# Altium schematic sheet 5-ThermoHygroSensor.SchDoc
size A4; Author: Fabian Castaño; CompanyName: UdeA; Engineer: Fabian Castaño; Organization: Universidad de Antioquia; Address1: UdeA; Address2: Medellín; Address3: Antioquia; Address4: Colombia 050010; DocumentNumber: 6; Revision: Jaime Osorio; SheetNumber: 6; SheetTotal: 12
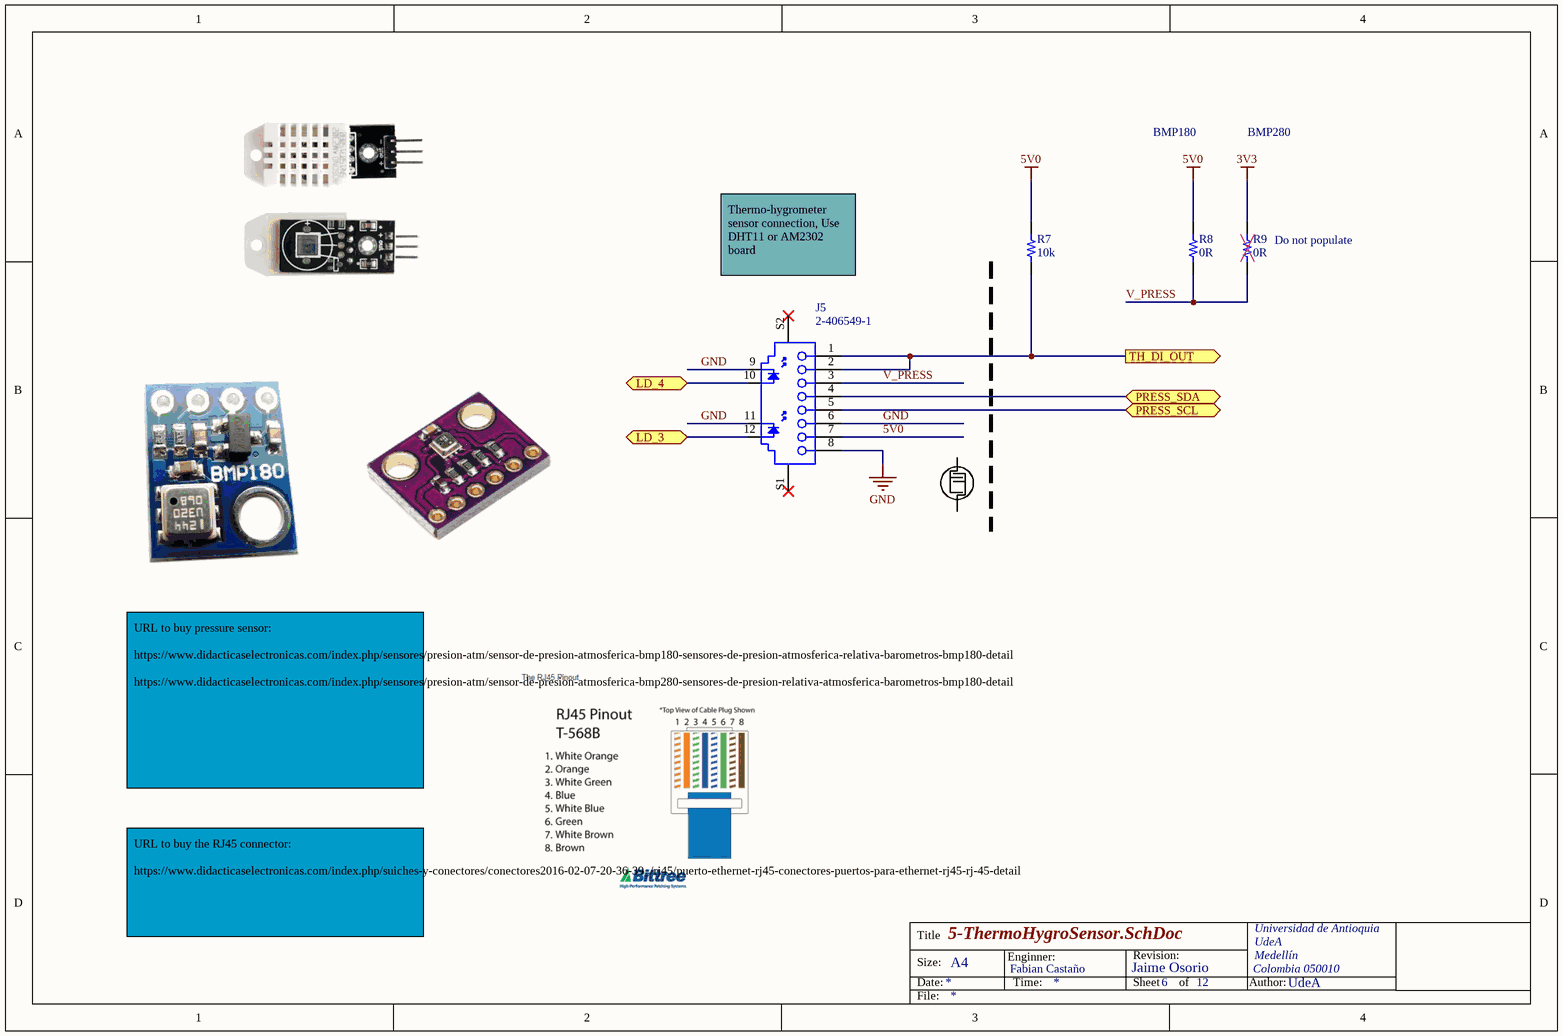
[diagram p0: 5-ThermoHygroSensor.SchDoc]

## Parts
J5  2-406549-1  [TECO-2-406549-1_V]
R7  10k  [RES 0805_2012]
R8  0R  [RES 0805_2012]
R9  0R  [RES 0805_2012]

## Ports
LD_3 (bidir), LD_4 (bidir), PRESS_SCL, PRESS_SDA, TH_DI_OUT (out)

## Nets
3V3: R9.2
5V0: J5.7 R7.2 R8.2
GND: J5.6 J5.8 J5.9 J5.11
LD_3: J5.12 ; port LD_3
LD_4: J5.10 ; port LD_4
PRESS_SCL: J5.5 ; port PRESS_SCL
PRESS_SDA: J5.4 ; port PRESS_SDA
TH_DI_OUT: J5.1 J5.2 R7.1 ; port TH_DI_OUT
V_PRESS: J5.3 R8.1 R9.1

Not connected (* = marked no-connect by the designer): J5 S1* S2*

## Notes on the sheet
- BMP180
- BMP280
- (near R9) Do not populate
- Thermo-hygrometer sensor connection, Use DHT11 or AM2302 board
- URL to buy pressure sensor:
  https://www.didacticaselectronicas.com/index.php/sensores/presion-atm/sensor-de-presion-atmosferica-bmp180-sensores-de-presion-atmosferica-relativa-barometros-bmp180-detail
  https://www.didacticaselectronicas.com/index.php/sensores/presion-atm/sensor-de-presion-atmosferica-bmp280-sensores-de-presion-relativa-atmosferica-barometros-bmp180-detail
- URL to buy the RJ45 connector:
  https://www.didacticaselectronicas.com/index.php/suiches-y-conectores/conectores2016-02-07-20-36-39_/rj45/puerto-ethernet-rj45-conectores-puertos-para-ethernet-rj45-rj-45-detail
- Title
- Size:
- Date:
- A4
- Enginner:
- Time:
- Revision:
- Sheet
- of
- Author:
- File:

## Library data of the parts
J5 = CMP-2000-05541-1: RJ45 Connector, Pitch 1.016 mm, 8 Position, Height 14.22 mm, Tail Length 3.18 mm, RoHS, Tray; Manufacturer: TE Connectivity; Number of Ports: 1; Tab Direction: Up; Ratings: Cat5; Catalog Drawings: JackSideEntryInverted / JackSideEntryInvertedSide; Number of Positions/Contacts: 8p8c(RJ45,Ethernet); 3D Model: 2-406549-1.pdf; Other Names: 2-406549-1-ND / A97715; Shielding: Shielded,EMIFinger; LED Color: Yellow-Green; Dynamic Catalog: ModularJacks; Connector Type: Jack; Termination: Solder; Mounting Type: ThroughHole; Datasheet URL: http://www.te.com/commerce/DocumentDelivery/DDEController?Action=showdoc&DocId=Customer+Drawing%7F406549%7FT%7Fpdf%7FEnglish%7FENG_CD_406549_T.pdf%7F2-406549-1; Mounting Technology: ThroughHole; Package Reference: 2-406549-1; RoHS Information: 2-406549-1StatementofCompliance; Housing Material: Thermoplastic; Standard Package: 63; Number of Rows: 1; Category: Connectors,Interconnects; Contact Material: PhosphorBronze; Contact Finish Thickness: 50µin(1.27µm); Family: ModularConnectors-Jacks; Packaging: Tray; Datasheet Version: Rev. T, 11/2014; Operating Temperature: -40°C~85°C; Orientation: 90°Angle(Right); Contact Finish: Gold; Features: BoardGuide; Package Description: RJ45 Connector, Pitch 1.016 mm, 8 Position, Height 14.22 mm, Tail Length 3.18 mm; Manufacturer URL: http://www.te.com/
R7-R9 = RC0805FR-071K47L: RES SMD 1.47K OHM 1% 1/8W 0805; Manufacturer: Yageo; Power (Watts): 0.125W, 1/8W; Resistance: 1.47 kOhms; Temperature Coefficient: ±100ppm/°C; Part Number: RC0805FR-071K47L; ComponentLink1Description: Datasheet; ComponentLink1URL: https://www.yageo.com/upload/media/product/productsearch/datasheet/rchip/PYu-RC_Group_51_RoHS_L_10.pdf; ComponentLink2Description: DigiKey Link; ComponentLink2URL: http://digikey.com/product-detail/en/yageo/RC0805FR-071K47L/311-1.47KCRCT-ND/730440; Composition: Thick Film; Device Package: 0805 (2012 Metric); Features: Moisture Resistant; Height - Seated (Max): 0.024" (0.60mm); LastUpdated: 2/09/2020 01:14:46; Lifecycle Status: Active; Minimum Order: 1; Number of Terminations: 2; Operating Temperature: -55°C ~ 155°C; Package / Case: 0805 (2012 Metric); Packaging: CutTape; PartId: 44768; Part Status: Active; Price: 0.10; Series: RC; Size / Dimension: 0.079" L x 0.049" W (2.00mm x 1.25mm); Supplier 1: DigiKey; Supplier Part Number 1: 311-1.47KCRCT-ND; Supplier Device Package: 0805; Tolerance: ±1%
  R7: Value: 10k
  R8 R9: Value: 0R